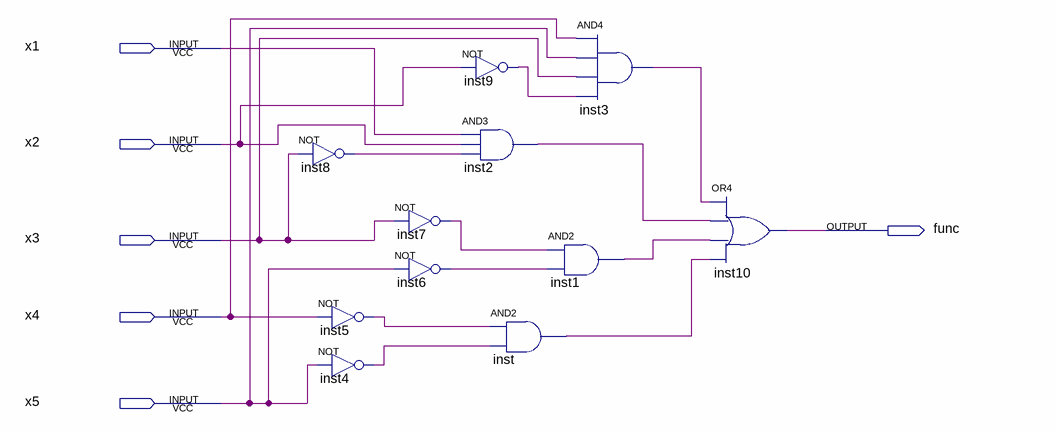
[diagram p0: schematic sheet]
// Quartus schematic pr1_er3.bdf as structural Verilog: 11 symbols, 6 pins
module pr1_er3 (
  input  x1,
  input  x2,
  input  x3,
  input  x4,
  input  x5,
  output func
);

  wire inst1_out, inst2_out, inst3_out, inst4_out, inst5_out, inst6_out, inst7_out, inst8_out, inst9_out,
       inst_out;

  not inst8 (inst8_out, x3);
  not inst5 (inst5_out, x4);
  not inst4 (inst4_out, x5);
  not inst9 (inst9_out, x2);
  and inst2 (inst2_out, x1, x2, inst8_out);
  not inst7 (inst7_out, x3);
  not inst6 (inst6_out, x5);
  and inst (inst_out, inst5_out, inst4_out);
  and inst3 (inst3_out, x4, x5, x3, inst9_out);
  and inst1 (inst1_out, inst7_out, inst6_out);
  or inst10 (func, inst3_out, inst2_out, inst1_out, inst_out);
endmodule
